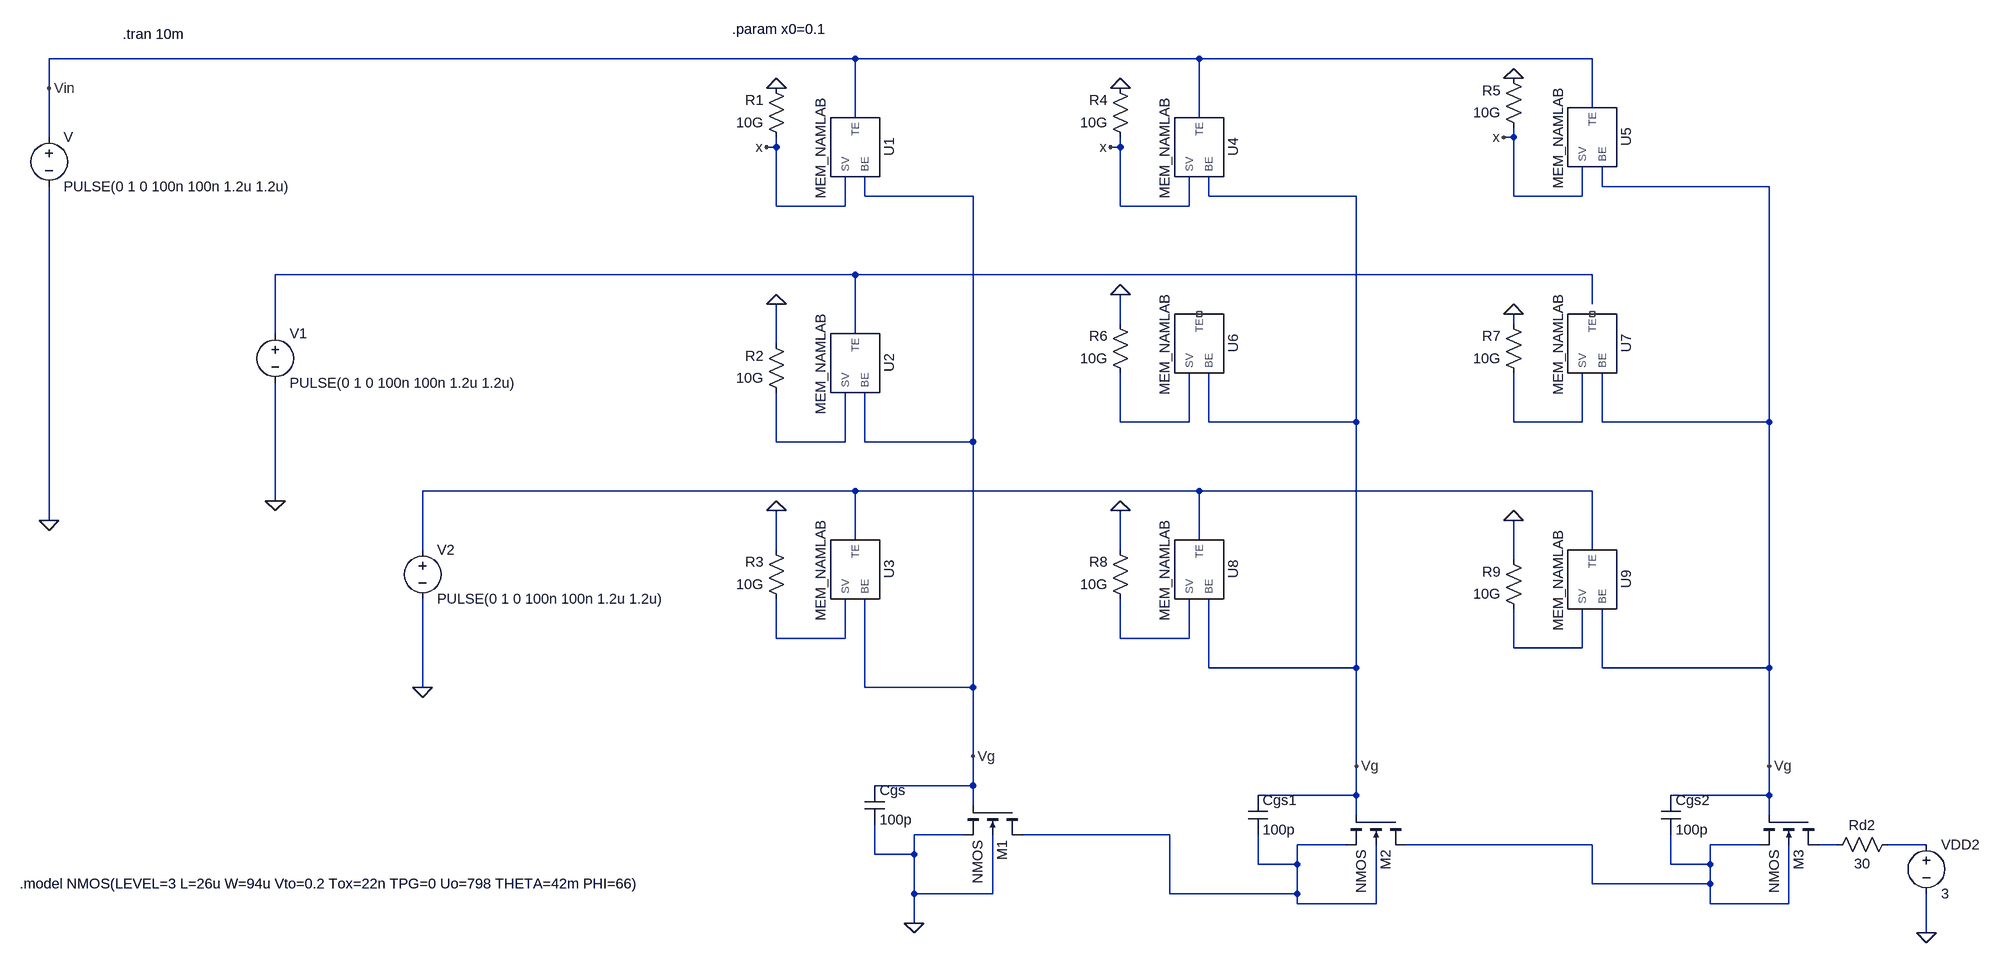
[diagram p0: schematic 3x3_neuro memrsitor.asc]
3x3_neuro memrsitor.asc, the LTspice schematic file:
Version 4
SHEET 1 2316 1284
WIRE 480 -160 -832 -160
WIRE 1040 -160 480 -160
WIRE 1680 -160 1040 -160
WIRE -832 -112 -832 -160
WIRE 1680 -80 1680 -160
WIRE 480 -64 480 -160
WIRE 1040 -64 1040 -160
WIRE -832 -32 -832 -112
WIRE 1552 -32 1552 -48
WIRE 1552 -32 1536 -32
WIRE 352 -16 352 -32
WIRE 352 -16 336 -16
WIRE 912 -16 912 -32
WIRE 912 -16 896 -16
WIRE 1696 48 1696 16
WIRE 1968 48 1696 48
WIRE 496 64 496 32
WIRE 672 64 496 64
WIRE 1056 64 1056 32
WIRE 1296 64 1056 64
WIRE 1552 64 1552 -32
WIRE 1664 64 1664 16
WIRE 1664 64 1552 64
WIRE 352 80 352 -16
WIRE 464 80 464 32
WIRE 464 80 352 80
WIRE 912 80 912 -16
WIRE 1024 80 1024 32
WIRE 1024 80 912 80
WIRE 480 192 -464 192
WIRE 1680 192 480 192
WIRE 1680 240 1680 192
WIRE 912 272 912 224
WIRE 1552 272 1552 256
WIRE -464 288 -464 192
WIRE 480 288 480 192
WIRE 352 304 352 240
WIRE 912 432 912 352
WIRE 1024 432 1024 352
WIRE 1024 432 912 432
WIRE 1056 432 1056 352
WIRE 1296 432 1296 64
WIRE 1296 432 1056 432
WIRE 1552 432 1552 352
WIRE 1664 432 1664 352
WIRE 1664 432 1552 432
WIRE 1696 432 1696 352
WIRE 1968 432 1968 48
WIRE 1968 432 1696 432
WIRE 352 464 352 384
WIRE 464 464 464 384
WIRE 464 464 352 464
WIRE 496 464 496 384
WIRE 672 464 672 64
WIRE 672 464 496 464
WIRE 480 544 -224 544
WIRE 1040 544 480 544
WIRE 1680 544 1040 544
WIRE -464 560 -464 368
WIRE -832 592 -832 48
WIRE 480 624 480 544
WIRE 1040 624 1040 544
WIRE -224 640 -224 544
WIRE 352 640 352 576
WIRE 912 640 912 576
WIRE 1680 640 1680 544
WIRE 1552 656 1552 592
WIRE 352 784 352 720
WIRE 464 784 464 720
WIRE 464 784 352 784
WIRE 912 784 912 720
WIRE 1024 784 1024 720
WIRE 1024 784 912 784
WIRE 1552 800 1552 736
WIRE 1664 800 1664 736
WIRE 1664 800 1552 800
WIRE 1056 832 1056 720
WIRE 1296 832 1296 432
WIRE 1296 832 1056 832
WIRE 1696 832 1696 736
WIRE 1968 832 1968 432
WIRE 1968 832 1696 832
WIRE -224 864 -224 720
WIRE 496 864 496 720
WIRE 672 864 672 464
WIRE 672 864 496 864
WIRE 672 976 672 864
WIRE 1296 992 1296 832
WIRE 1968 992 1968 832
WIRE 672 1024 672 976
WIRE 672 1024 512 1024
WIRE 1296 1040 1296 992
WIRE 1296 1040 1136 1040
WIRE 1968 1040 1968 992
WIRE 1968 1040 1808 1040
WIRE 672 1056 672 1024
WIRE 1296 1072 1296 1040
WIRE 1968 1072 1968 1040
WIRE 656 1104 576 1104
WIRE 992 1104 752 1104
WIRE 1280 1120 1200 1120
WIRE 1680 1120 1376 1120
WIRE 1952 1120 1872 1120
WIRE 2080 1120 2048 1120
WIRE 2224 1120 2160 1120
WIRE 512 1136 512 1088
WIRE 576 1136 576 1104
WIRE 576 1136 512 1136
WIRE 1136 1152 1136 1104
WIRE 1200 1152 1200 1120
WIRE 1200 1152 1136 1152
WIRE 1808 1152 1808 1104
WIRE 1872 1152 1872 1120
WIRE 1872 1152 1808 1152
WIRE 1680 1184 1680 1120
WIRE 1872 1184 1872 1152
WIRE 1872 1184 1680 1184
WIRE 576 1200 576 1136
WIRE 704 1200 704 1104
WIRE 704 1200 576 1200
WIRE 992 1200 992 1104
WIRE 1200 1200 1200 1152
WIRE 1200 1200 992 1200
WIRE 1200 1216 1200 1200
WIRE 1328 1216 1328 1120
WIRE 1328 1216 1200 1216
WIRE 1872 1216 1872 1184
WIRE 2000 1216 2000 1120
WIRE 2000 1216 1872 1216
WIRE 576 1248 576 1200
WIRE 2224 1264 2224 1200
FLAG -832 592 0
FLAG 336 -16 x
FLAG 576 1248 0
FLAG -832 -112 Vin
FLAG 672 976 Vg
FLAG 352 -112 0
FLAG -224 864 0
FLAG -464 560 0
FLAG 352 240 0
FLAG 352 576 0
FLAG 1296 992 Vg
FLAG 2224 1264 0
FLAG 1968 992 Vg
FLAG 896 -16 x
FLAG 912 -112 0
FLAG 1536 -32 x
FLAG 1552 -128 0
FLAG 1552 256 0
FLAG 912 576 0
FLAG 1552 592 0
FLAG 912 224 0
SYMBOL voltage -832 -48 R0
WINDOW 123 0 0 Left 0
WINDOW 39 0 0 Left 0
SYMATTR InstName V
SYMATTR Value PULSE(0 1 0 100n 100n 1.2u 1.2u)
SYMBOL nmos4 752 1056 R90
SYMATTR InstName M1
SYMBOL cap 496 1024 R0
SYMATTR InstName Cgs
SYMATTR Value 100p
SYMBOL res 368 -16 R180
WINDOW 0 36 76 Left 2
WINDOW 3 36 40 Left 2
SYMATTR InstName R1
SYMATTR Value 10G
SYMBOL MEM_NAMLAB\ mit\ cap 480 -16 R90
SYMATTR InstName U1
SYMBOL MEM_NAMLAB\ mit\ cap 480 336 R90
SYMATTR InstName U2
SYMBOL voltage -464 272 R0
WINDOW 123 0 0 Left 0
WINDOW 39 0 0 Left 0
SYMATTR InstName V1
SYMATTR Value PULSE(0 1 0 100n 100n 1.2u 1.2u)
SYMBOL voltage -224 624 R0
WINDOW 123 0 0 Left 0
WINDOW 39 0 0 Left 0
SYMATTR InstName V2
SYMATTR Value PULSE(0 1 0 100n 100n 1.2u 1.2u)
SYMBOL MEM_NAMLAB\ mit\ cap 480 672 R90
SYMATTR InstName U3
SYMBOL res 368 400 R180
WINDOW 0 36 76 Left 2
WINDOW 3 36 40 Left 2
SYMATTR InstName R2
SYMATTR Value 10G
SYMBOL res 368 736 R180
WINDOW 0 36 76 Left 2
WINDOW 3 36 40 Left 2
SYMATTR InstName R3
SYMATTR Value 10G
SYMBOL nmos4 1376 1072 R90
SYMATTR InstName M2
SYMBOL cap 1120 1040 R0
SYMATTR InstName Cgs1
SYMATTR Value 100p
SYMBOL voltage 2224 1104 R0
SYMATTR InstName VDD2
SYMATTR Value 3
SYMBOL res 2176 1104 R90
WINDOW 0 0 56 VBottom 2
WINDOW 3 32 56 VTop 2
SYMATTR InstName Rd2
SYMATTR Value 30
SYMBOL nmos4 2048 1072 R90
SYMATTR InstName M3
SYMBOL cap 1792 1040 R0
SYMATTR InstName Cgs2
SYMATTR Value 100p
SYMBOL res 928 -16 R180
WINDOW 0 36 76 Left 2
WINDOW 3 36 40 Left 2
SYMATTR InstName R4
SYMATTR Value 10G
SYMBOL MEM_NAMLAB\ mit\ cap 1040 -16 R90
SYMATTR InstName U4
SYMBOL res 1568 -32 R180
WINDOW 0 36 76 Left 2
WINDOW 3 36 40 Left 2
SYMATTR InstName R5
SYMATTR Value 10G
SYMBOL MEM_NAMLAB\ mit\ cap 1680 -32 R90
SYMATTR InstName U5
SYMBOL MEM_NAMLAB\ mit\ cap 1040 304 R90
SYMATTR InstName U6
SYMBOL res 928 368 R180
WINDOW 0 36 76 Left 2
WINDOW 3 36 40 Left 2
SYMATTR InstName R6
SYMATTR Value 10G
SYMBOL MEM_NAMLAB\ mit\ cap 1680 304 R90
SYMATTR InstName U7
SYMBOL res 1568 368 R180
WINDOW 0 36 76 Left 2
WINDOW 3 36 40 Left 2
SYMATTR InstName R7
SYMATTR Value 10G
SYMBOL MEM_NAMLAB\ mit\ cap 1040 672 R90
SYMATTR InstName U8
SYMBOL res 928 736 R180
WINDOW 0 36 76 Left 2
WINDOW 3 36 40 Left 2
SYMATTR InstName R8
SYMATTR Value 10G
SYMBOL MEM_NAMLAB\ mit\ cap 1680 688 R90
SYMATTR InstName U9
SYMBOL res 1568 752 R180
WINDOW 0 36 76 Left 2
WINDOW 3 36 40 Left 2
SYMATTR InstName R9
SYMATTR Value 10G
TEXT -712 -200 Left 2 !.tran 10m
TEXT 280 -208 Left 2 !.param x0=0.1
TEXT -880 1184 Left 2 !.model NMOS(LEVEL=3 L=26u W=94u Vto=0.2 Tox=22n TPG=0 Uo=798 THETA=42m PHI=66)

The netlist it stands for:
* 3x3_neuro memrsitor.asc
V Vin 0 PULSE(0 1 0 100n 100n 1.2u 1.2u)
M1 N009 Vg 0 0 NMOS
Cgs Vg 0 100p
R1 x 0 10G
XU1 Vin Vg x MEM_NAMLAB  ; pins TE BE SV
XU2 N001 Vg N004 MEM_NAMLAB  ; pins TE BE SV
V1 N001 0 PULSE(0 1 0 100n 100n 1.2u 1.2u)
V2 N005 0 PULSE(0 1 0 100n 100n 1.2u 1.2u)
XU3 N005 Vg N006 MEM_NAMLAB  ; pins TE BE SV
R2 N004 0 10G
R3 N006 0 10G
M2 N010 Vg N009 N009 NMOS
Cgs1 Vg N009 100p
VDD2 N012 0 3
Rd2 N012 N011 30
M3 N011 Vg N010 N010 NMOS
Cgs2 Vg N010 100p
R4 x 0 10G
XU4 Vin Vg x MEM_NAMLAB  ; pins TE BE SV
R5 x 0 10G
XU5 Vin Vg x MEM_NAMLAB  ; pins TE BE SV
XU6 NC_01 Vg N002 MEM_NAMLAB  ; pins TE BE SV
R6 N002 0 10G
XU7 NC_02 Vg N003 MEM_NAMLAB  ; pins TE BE SV
R7 N003 0 10G
XU8 N005 Vg N007 MEM_NAMLAB  ; pins TE BE SV
R8 N007 0 10G
XU9 N005 Vg N008 MEM_NAMLAB  ; pins TE BE SV
R9 N008 0 10G
.model NMOS NMOS
.model PMOS PMOS
.lib standard.mos
.tran 10m
.param x0=0.1
.model NMOS(LEVEL=3 L=26u W=94u Vto=0.2 Tox=22n TPG=0 Uo=798 THETA=42m PHI=66)
.lib C:\Users\dhanu\OneDrive\Documents\My files\GITHUB\Neuro-transistor-Simulation-with-Memristor-based-Memcapacitor-using-LTSPICE\src\task9\MEM_NAMLAB.cir
.backanno
.end